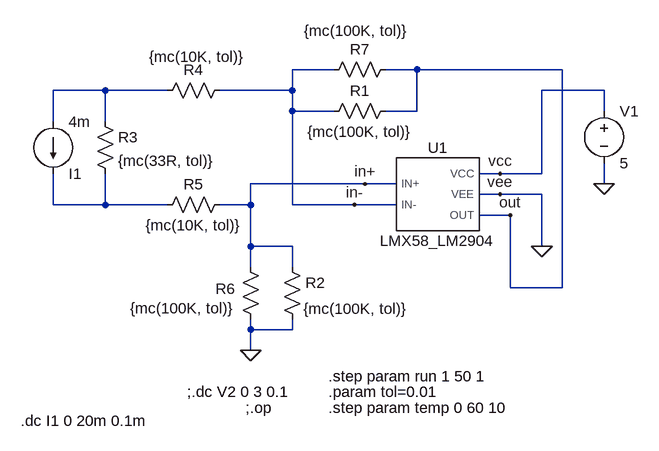
[diagram p0: schematic 4-20mA_test1.asc]
4-20mA_test1.asc, the LTspice schematic file:
Version 4
SHEET 1 1076 680
WIRE 16 -16 -48 -16
WIRE 144 -16 96 -16
WIRE 368 -16 144 -16
WIRE -336 16 -416 16
WIRE -240 16 -336 16
WIRE -48 16 -48 -16
WIRE -48 16 -160 16
WIRE 432 16 336 16
WIRE -48 48 -48 16
WIRE 16 48 -48 48
WIRE 144 48 144 -16
WIRE 144 48 96 48
WIRE 432 48 432 16
WIRE -416 64 -416 16
WIRE -336 64 -336 16
WIRE 272 144 240 144
WIRE 336 144 336 16
WIRE 336 144 272 144
WIRE 64 160 -112 160
WIRE 112 160 64 160
WIRE 432 160 432 128
WIRE 272 176 240 176
WIRE 336 176 272 176
WIRE -416 192 -416 144
WIRE -336 192 -336 144
WIRE -336 192 -416 192
WIRE -240 192 -336 192
WIRE -112 192 -112 160
WIRE -112 192 -160 192
WIRE -48 192 -48 48
WIRE 48 192 -48 192
WIRE 112 192 48 192
WIRE 288 208 240 208
WIRE -112 256 -112 192
WIRE -48 256 -112 256
WIRE 336 256 336 176
WIRE -112 288 -112 256
WIRE -48 288 -48 256
WIRE 288 320 288 208
WIRE 368 320 368 -16
WIRE 368 320 288 320
WIRE -112 384 -112 368
WIRE -48 384 -48 368
WIRE -48 384 -112 384
WIRE -112 416 -112 384
FLAG 336 256 0
FLAG 288 208 out
FLAG 272 144 vcc
FLAG 272 176 vee
FLAG 48 192 in-
FLAG 64 160 in+
FLAG -112 416 0
FLAG 432 160 0
SYMBOL AutoGenerated\\LMX58_LM2904 176 176 R0
SYMATTR InstName U1
SYMBOL voltage 432 32 R0
WINDOW 123 0 0 Left 0
WINDOW 39 0 0 Left 0
SYMATTR InstName V1
SYMATTR Value 5
SYMBOL res 112 32 R90
WINDOW 0 0 56 VBottom 2
WINDOW 3 32 56 VTop 2
SYMATTR InstName R1
SYMATTR Value {mc(100K, tol)}
SYMBOL res -64 272 R0
WINDOW 3 33 80 Left 2
SYMATTR InstName R2
SYMATTR Value {mc(100K, tol)}
SYMBOL current -416 64 R0
WINDOW 0 24 80 Left 2
WINDOW 3 24 0 Left 2
WINDOW 123 0 0 Left 0
WINDOW 39 0 0 Left 0
SYMATTR InstName I1
SYMATTR Value 4m
SYMBOL res -352 48 R0
SYMATTR InstName R3
SYMATTR Value {mc(33R, tol)}
SYMATTR SpiceLine tol=1
SYMBOL res -256 32 R270
WINDOW 0 32 56 VTop 2
WINDOW 3 83 61 VBottom 2
SYMATTR InstName R4
SYMATTR Value {mc(10K, tol)}
SYMBOL res -144 176 R90
WINDOW 0 0 56 VBottom 2
WINDOW 3 32 56 VTop 2
SYMATTR InstName R5
SYMATTR Value {mc(10K, tol)}
SYMBOL res -128 272 R0
WINDOW 0 -38 49 Left 2
WINDOW 3 -170 79 Left 2
SYMATTR InstName R6
SYMATTR Value {mc(100K, tol)}
SYMBOL res 112 -32 R90
WINDOW 0 0 56 VBottom 2
WINDOW 3 -59 62 VTop 2
SYMATTR InstName R7
SYMATTR Value {mc(100K, tol)}
TEXT -210 480 Left 2 !;.dc V2 0 3 0.1
TEXT 8 456 Left 2 !.step param run 1 50 1
TEXT 8 480 Left 2 !.param tol=0.01
TEXT 8 504 Left 2 !.step param temp 0 60 10
TEXT -120 504 Left 2 !;.op
TEXT -466 524 Left 2 !.dc I1 0 20m 0.1m

The netlist it stands for:
* 4-20mA_test1.asc
XU1 in+ in- vcc 0 out LMX58_LM2904  ; pins IN+ IN- VCC VEE OUT
V1 vcc 0 5
R1 out in- {mc(100K, tol)}
R2 in+ 0 {mc(100K, tol)}
I1 N001 N002 4m
R3 N001 N002 {mc(33R, tol)} tol=1
R4 N001 in- {mc(10K, tol)}
R5 in+ N002 {mc(10K, tol)}
R6 in+ 0 {mc(100K, tol)}
R7 out in- {mc(100K, tol)}
;.dc V2 0 3 0.1
.step param run 1 50 1
.param tol=0.01
.step param temp 0 60 10
;.op
.dc I1 0 20m 0.1m
.lib C:\Users\gabri\Desktop\SNOM268A\LMx58_LM2904.CIR
.backanno
.end